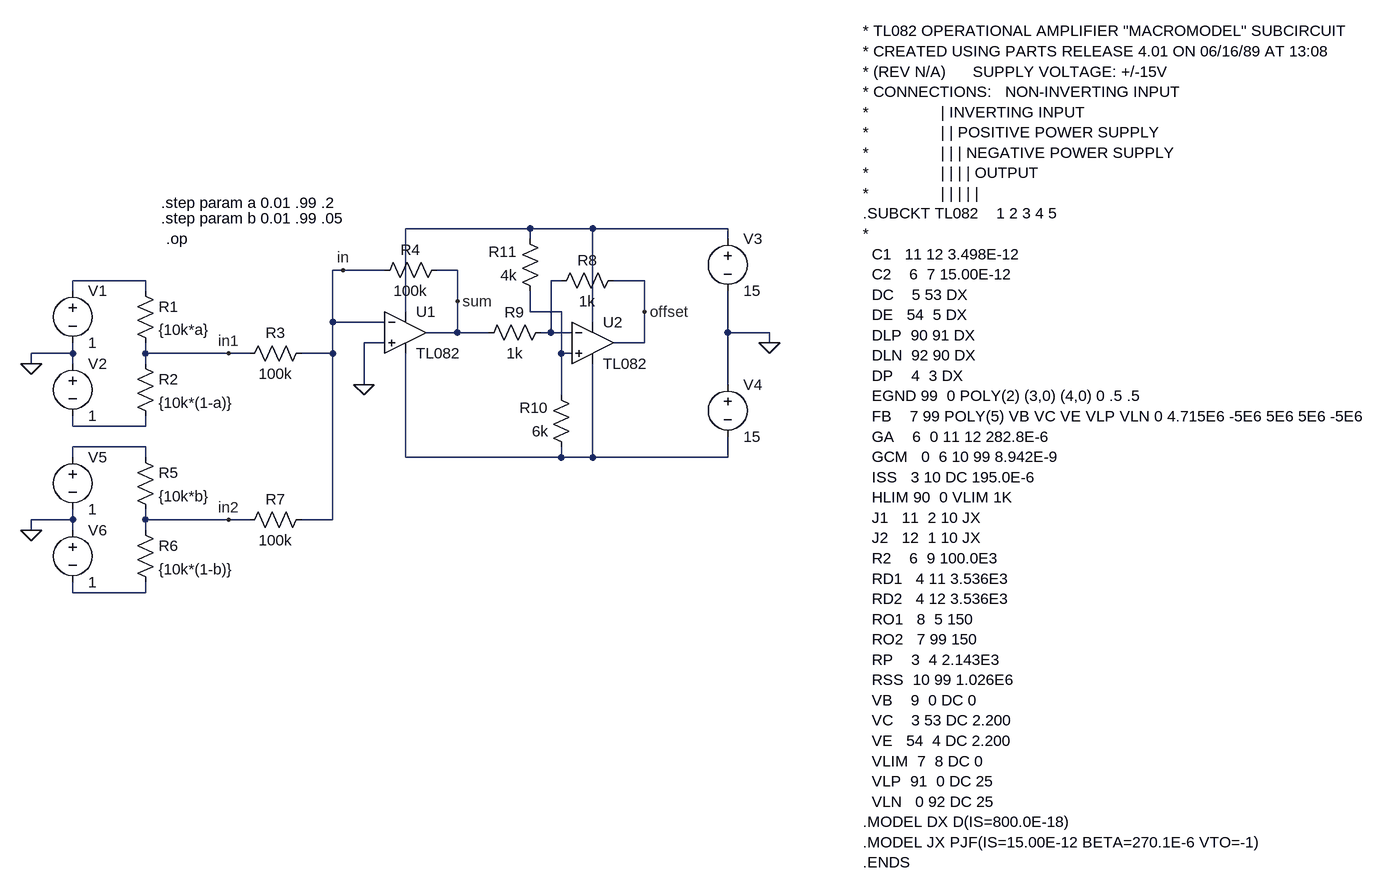
[diagram p0: schematic Fourier_adder.asc]
Fourier_adder.asc, the LTspice schematic file:
Version 4
SHEET 1 1732 1036
WIRE 448 176 256 176
WIRE 544 176 448 176
WIRE 752 176 544 176
WIRE 448 192 448 176
WIRE 752 192 752 176
WIRE 160 240 144 240
WIRE 224 240 160 240
WIRE 336 240 304 240
WIRE -144 256 -256 256
WIRE 496 256 480 256
WIRE 624 256 576 256
WIRE -256 272 -256 256
WIRE -144 272 -144 256
WIRE 336 288 336 240
WIRE 256 304 256 176
WIRE 448 304 448 272
WIRE 496 304 448 304
WIRE 624 304 624 256
WIRE 144 320 144 240
WIRE 224 320 144 320
WIRE 544 320 544 176
WIRE 336 336 336 288
WIRE 336 336 288 336
WIRE 384 336 336 336
WIRE 480 336 480 256
WIRE 480 336 464 336
WIRE 512 336 480 336
WIRE 752 336 752 272
WIRE 816 336 752 336
WIRE 224 352 192 352
WIRE 624 352 624 304
WIRE 624 352 576 352
WIRE 816 352 816 336
WIRE -256 368 -256 352
WIRE -256 368 -320 368
WIRE -144 368 -144 352
WIRE -16 368 -144 368
WIRE 16 368 -16 368
WIRE 144 368 144 320
WIRE 144 368 96 368
WIRE 496 368 496 304
WIRE 512 368 496 368
WIRE -320 384 -320 368
WIRE -256 384 -256 368
WIRE -144 384 -144 368
WIRE 192 416 192 352
WIRE 752 416 752 336
WIRE 496 432 496 368
WIRE -256 480 -256 464
WIRE -144 480 -144 464
WIRE -144 480 -256 480
WIRE -144 512 -256 512
WIRE -256 528 -256 512
WIRE -144 528 -144 512
WIRE 256 528 256 368
WIRE 496 528 496 512
WIRE 496 528 256 528
WIRE 544 528 544 384
WIRE 544 528 496 528
WIRE 752 528 752 496
WIRE 752 528 544 528
WIRE -256 624 -256 608
WIRE -256 624 -320 624
WIRE -144 624 -144 608
WIRE -16 624 -144 624
WIRE 16 624 -16 624
WIRE 144 624 144 368
WIRE 144 624 96 624
WIRE -320 640 -320 624
WIRE -256 640 -256 624
WIRE -144 640 -144 624
WIRE -256 736 -256 720
WIRE -144 736 -144 720
WIRE -144 736 -256 736
FLAG 192 416 0
FLAG -320 384 0
FLAG 816 352 0
FLAG -320 640 0
FLAG -16 368 in1
FLAG -16 624 in2
FLAG 160 240 in
FLAG 336 288 sum
FLAG 624 304 offset
SYMBOL res -160 256 R0
SYMATTR InstName R1
SYMATTR Value {10k*a}
SYMBOL res -160 368 R0
SYMATTR InstName R2
SYMATTR Value {10k*(1-a)}
SYMBOL res 112 352 R90
WINDOW 0 0 56 VBottom 2
WINDOW 3 32 56 VTop 2
SYMATTR InstName R3
SYMATTR Value 100k
SYMBOL voltage -256 256 R0
WINDOW 123 0 0 Left 0
WINDOW 39 0 0 Left 0
SYMATTR InstName V1
SYMATTR Value 1
SYMBOL voltage -256 368 R0
WINDOW 123 0 0 Left 0
WINDOW 39 0 0 Left 0
SYMATTR InstName V2
SYMATTR Value 1
SYMBOL Opamps\\opamp2 256 272 R0
SYMATTR InstName U1
SYMATTR Value TL082
SYMBOL voltage 752 176 R0
WINDOW 123 0 0 Left 0
WINDOW 39 0 0 Left 0
SYMATTR InstName V3
SYMATTR Value 15
SYMBOL voltage 752 400 R0
WINDOW 123 0 0 Left 0
WINDOW 39 0 0 Left 0
SYMATTR InstName V4
SYMATTR Value 15
SYMBOL res 320 224 R90
WINDOW 0 0 56 VBottom 2
WINDOW 3 32 56 VTop 2
SYMATTR InstName R4
SYMATTR Value 100k
SYMBOL res -160 512 R0
SYMATTR InstName R5
SYMATTR Value {10k*b}
SYMBOL res -160 624 R0
SYMATTR InstName R6
SYMATTR Value {10k*(1-b)}
SYMBOL voltage -256 512 R0
WINDOW 123 0 0 Left 0
WINDOW 39 0 0 Left 0
SYMATTR InstName V5
SYMATTR Value 1
SYMBOL voltage -256 624 R0
WINDOW 123 0 0 Left 0
WINDOW 39 0 0 Left 0
SYMATTR InstName V6
SYMATTR Value 1
SYMBOL res 112 608 R90
WINDOW 0 0 56 VBottom 2
WINDOW 3 32 56 VTop 2
SYMATTR InstName R7
SYMATTR Value 100k
SYMBOL Opamps\\opamp2 544 288 R0
SYMATTR InstName U2
SYMATTR Value TL082
SYMBOL res 592 240 R90
WINDOW 0 0 56 VBottom 2
WINDOW 3 32 56 VTop 2
SYMATTR InstName R8
SYMATTR Value 1k
SYMBOL res 480 320 R90
WINDOW 0 0 56 VBottom 2
WINDOW 3 32 56 VTop 2
SYMATTR InstName R9
SYMATTR Value 1k
SYMBOL res 512 528 R180
WINDOW 0 36 76 Left 2
WINDOW 3 36 40 Left 2
SYMATTR InstName R10
SYMATTR Value 6k
SYMBOL res 464 288 R180
WINDOW 0 36 76 Left 2
WINDOW 3 36 40 Left 2
SYMATTR InstName R11
SYMATTR Value 4k
TEXT -120 160 Left 2 !.step param b 0.01 .99 .05
TEXT -112 192 Left 2 !.op
TEXT 960 -128 Left 2 !* TL082 OPERATIONAL AMPLIFIER "MACROMODEL" SUBCIRCUIT\n* CREATED USING PARTS RELEASE 4.01 ON 06/16/89 AT 13:08\n* (REV N/A)      SUPPLY VOLTAGE: +/-15V\n* CONNECTIONS:   NON-INVERTING INPUT\n*                | INVERTING INPUT\n*                | | POSITIVE POWER SUPPLY\n*                | | | NEGATIVE POWER SUPPLY\n*                | | | | OUTPUT\n*                | | | | |\n.SUBCKT TL082    1 2 3 4 5\n*\n  C1   11 12 3.498E-12\n  C2    6  7 15.00E-12\n  DC    5 53 DX\n  DE   54  5 DX\n  DLP  90 91 DX\n  DLN  92 90 DX\n  DP    4  3 DX\n  EGND 99  0 POLY(2) (3,0) (4,0) 0 .5 .5\n  FB    7 99 POLY(5) VB VC VE VLP VLN 0 4.715E6 -5E6 5E6 5E6 -5E6\n  GA    6  0 11 12 282.8E-6\n  GCM   0  6 10 99 8.942E-9\n  ISS   3 10 DC 195.0E-6\n  HLIM 90  0 VLIM 1K\n  J1   11  2 10 JX\n  J2   12  1 10 JX\n  R2    6  9 100.0E3\n  RD1   4 11 3.536E3\n  RD2   4 12 3.536E3\n  RO1   8  5 150\n  RO2   7 99 150\n  RP    3  4 2.143E3\n  RSS  10 99 1.026E6\n  VB    9  0 DC 0\n  VC    3 53 DC 2.200\n  VE   54  4 DC 2.200\n  VLIM  7  8 DC 0\n  VLP  91  0 DC 25\n  VLN   0 92 DC 25\n.MODEL DX D(IS=800.0E-18)\n.MODEL JX PJF(IS=15.00E-12 BETA=270.1E-6 VTO=-1)\n.ENDS
TEXT -120 136 Left 2 !.step param a 0.01 .99 .2

The netlist it stands for:
* Fourier_adder.asc
R1 N002 in1 {10k*a}
R2 in1 N005 {10k*(1-a)}
R3 in in1 100k
V1 N002 0 1
V2 0 N005 1
XU1 0 in N001 N007 sum TL082  ; pins In+ In- V+ V- OUT
V3 N001 0 15
V4 0 N007 15
R4 sum in 100k
R5 N006 in2 {10k*b}
R6 in2 N008 {10k*(1-b)}
V5 N006 0 1
V6 0 N008 1
R7 in in2 100k
XU2 N004 N003 N001 N007 offset TL082  ; pins In+ In- V+ V- OUT
R8 offset N003 1k
R9 N003 sum 1k
R10 N007 N004 6k
R11 N004 N001 4k
.step param b 0.01 .99 .05
.op
* TL082 OPERATIONAL AMPLIFIER "MACROMODEL" SUBCIRCUIT
* CREATED USING PARTS RELEASE 4.01 ON 06/16/89 AT 13:08
* (REV N/A)      SUPPLY VOLTAGE: +/-15V
* CONNECTIONS:   NON-INVERTING INPUT
*                | INVERTING INPUT
*                | | POSITIVE POWER SUPPLY
*                | | | NEGATIVE POWER SUPPLY
*                | | | | OUTPUT
*                | | | | |
.SUBCKT TL082    1 2 3 4 5
*
  C1   11 12 3.498E-12
  C2    6  7 15.00E-12
  DC    5 53 DX
  DE   54  5 DX
  DLP  90 91 DX
  DLN  92 90 DX
  DP    4  3 DX
  EGND 99  0 POLY(2) (3,0) (4,0) 0 .5 .5
  FB    7 99 POLY(5) VB VC VE VLP VLN 0 4.715E6 -5E6 5E6 5E6 -5E6
  GA    6  0 11 12 282.8E-6
  GCM   0  6 10 99 8.942E-9
  ISS   3 10 DC 195.0E-6
  HLIM 90  0 VLIM 1K
  J1   11  2 10 JX
  J2   12  1 10 JX
  R2    6  9 100.0E3
  RD1   4 11 3.536E3
  RD2   4 12 3.536E3
  RO1   8  5 150
  RO2   7 99 150
  RP    3  4 2.143E3
  RSS  10 99 1.026E6
  VB    9  0 DC 0
  VC    3 53 DC 2.200
  VE   54  4 DC 2.200
  VLIM  7  8 DC 0
  VLP  91  0 DC 25
  VLN   0 92 DC 25
.MODEL DX D(IS=800.0E-18)
.MODEL JX PJF(IS=15.00E-12 BETA=270.1E-6 VTO=-1)
.ENDS
.step param a 0.01 .99 .2
.backanno
.end